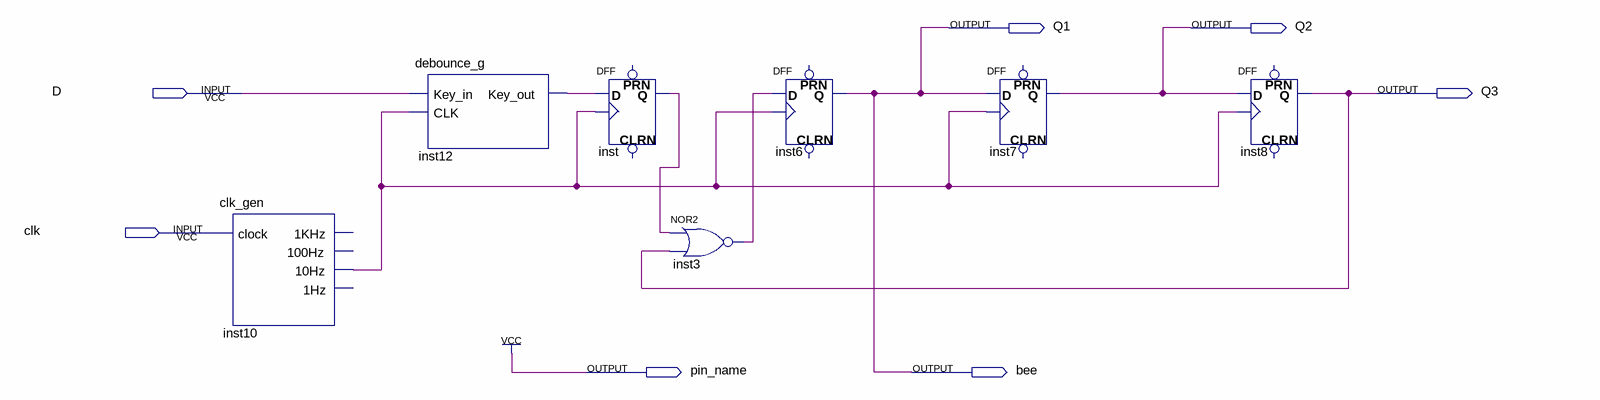
[diagram p0: schematic sheet]
// Quartus schematic DFFDFFDFFDFF.bdf as structural Verilog: 7 symbols, 7 pins
module DFFDFFDFFDFF (
  input  D,
  input  clk,
  output Q1,
  output Q2,
  output Q3,
  output pin_name,
  output bee
);

  wire inst3_out, inst10_10hz, inst12_key_out, inst_q;

  clk_gen inst10 (.clock(clk), .\10Hz (inst10_10hz));  // open: 1KHz, 100Hz, 1Hz
  debounce_g inst12 (.Key_in(D), .CLK(inst10_10hz), .Key_out(inst12_key_out));
  DFF inst (.CLK(inst10_10hz), .D(inst12_key_out), .Q(inst_q));  // open: CLRN, PRN
  nor inst3 (inst3_out, inst_q, Q3);
  DFF inst6 (.CLK(inst10_10hz), .D(inst3_out), .Q(bee));  // open: CLRN, PRN
  DFF inst7 (.CLK(inst10_10hz), .D(bee), .Q(Q2));  // open: CLRN, PRN
  DFF inst8 (.CLK(inst10_10hz), .D(Q2), .Q(Q3));  // open: CLRN, PRN

  assign pin_name = 1'b1;
  assign Q1 = bee;
endmodule
